# EAGLE design V01 (EAGLE 8.0.0)
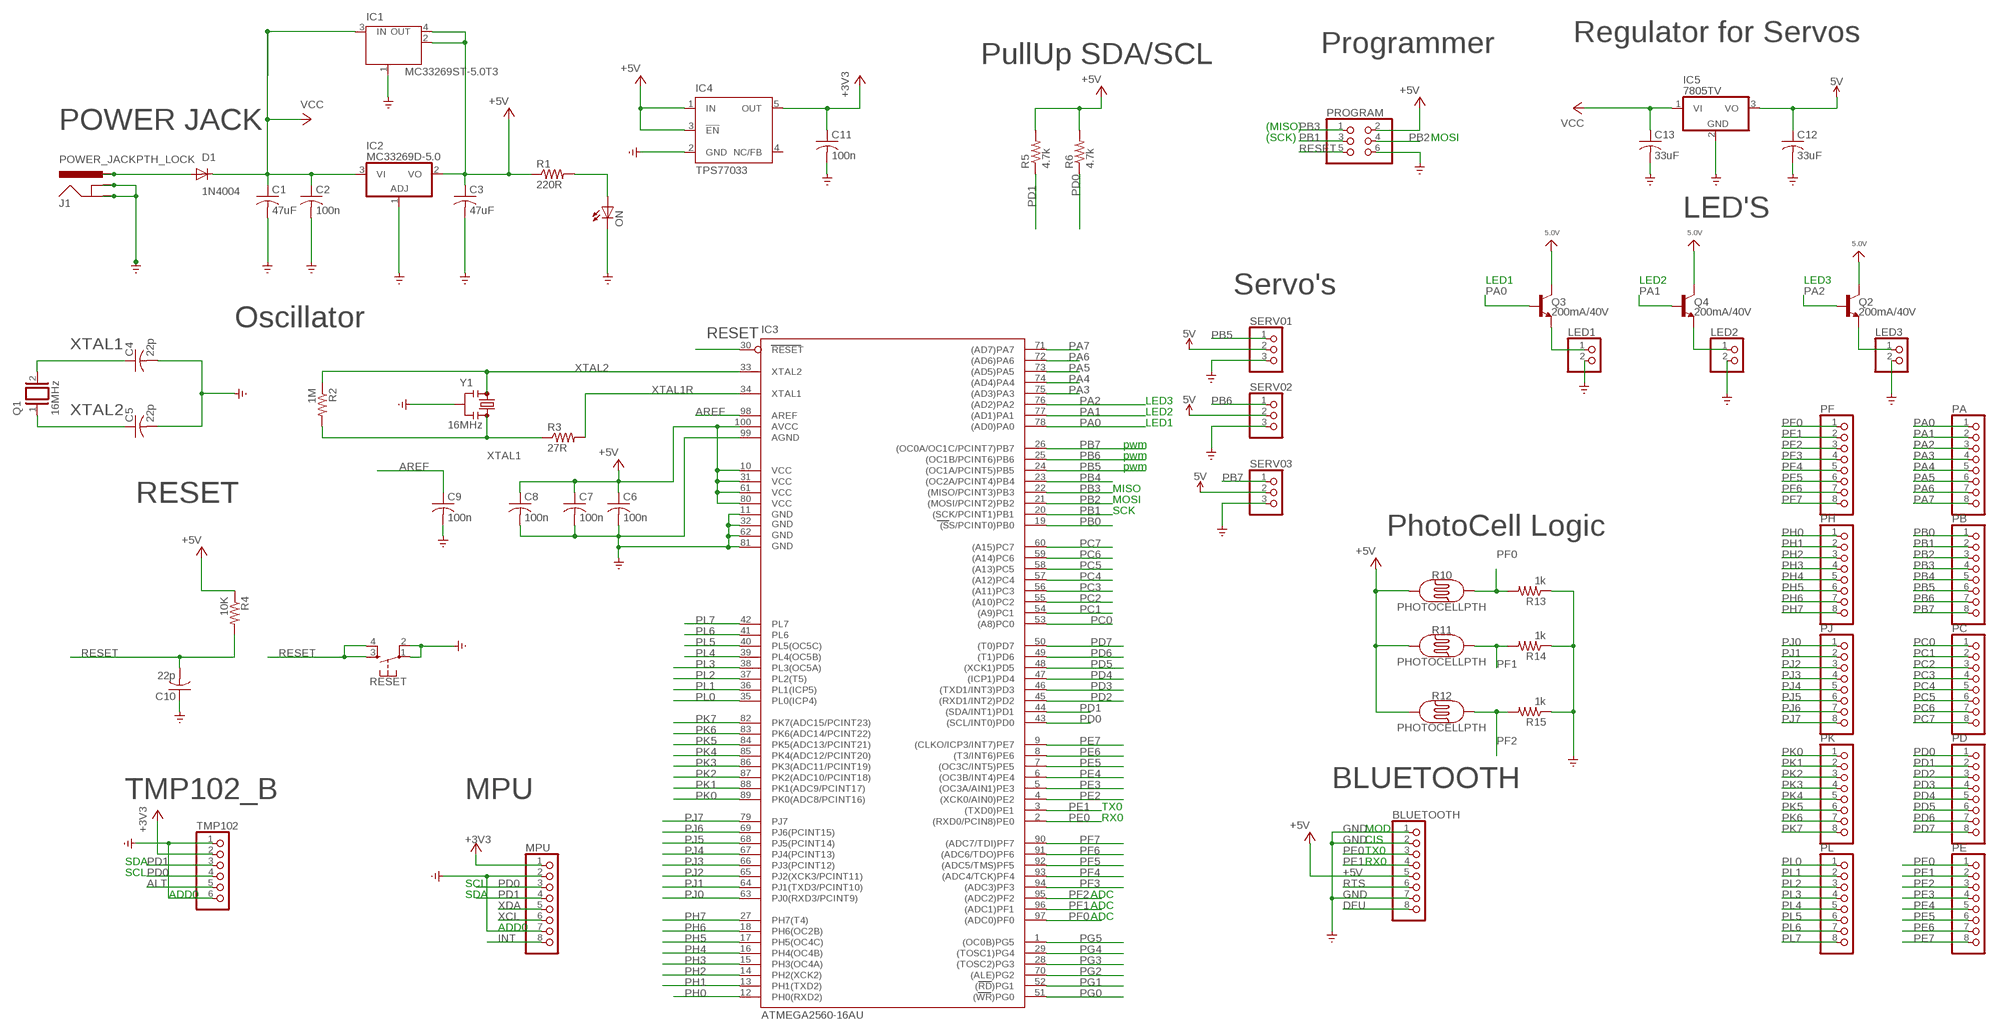
[diagram p0: schematic, sheet 1, part 1 of 2]
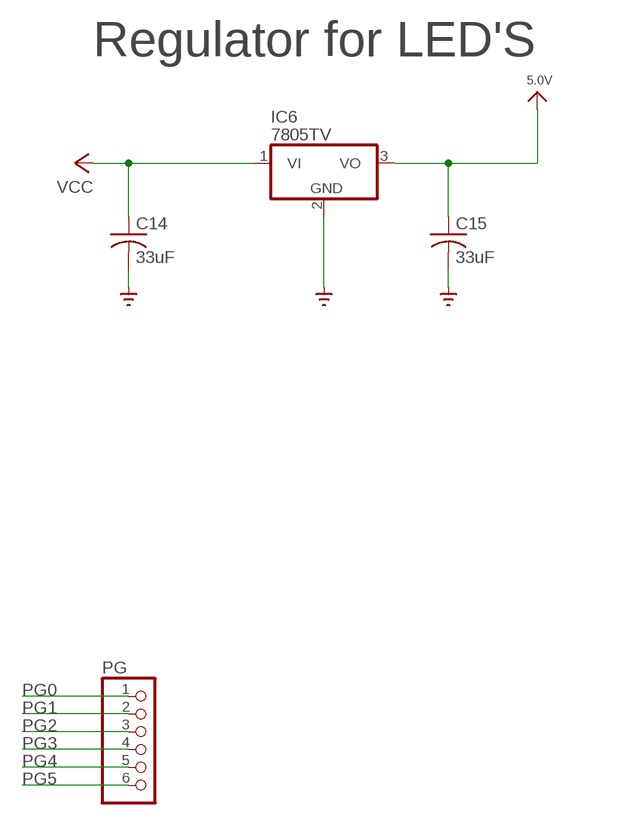
[diagram p1: schematic, sheet 1, part 2 of 2]

## Parts
BLUETOOTH  PINHD-1X8  [1X08]
C1  47uF  C-US025-024X044  [C025-024X044]
C2  100n  C-US025-024X044  [C025-024X044]
C3  47uF  C-US025-024X044  [C025-024X044]
C4  22p  C-US025-024X044  [C025-024X044]
C5  22p  C-US025-024X044  [C025-024X044]
C6  100n  C-US025-024X044  [C025-024X044]
C7  100n  C-US025-024X044  [C025-024X044]
C8  100n  C-US025-024X044  [C025-024X044]
C9  100n  C-US025-024X044  [C025-024X044]
C10  22p  C-US025-024X044  [C025-024X044]
C11  100n  C-US025-024X044  [C025-024X044]
C12  33uF  C-US025-024X044  [C025-024X044]
C13  33uF  C-US025-024X044  [C025-024X044]
C14  33uF  C-US025-024X044  [C025-024X044]
C15  33uF  C-US025-024X044  [C025-024X044]
D1  1N4004  [DO41-10]
IC1  MC33269ST-5.0T3  MC33269ST-3.3T3  [SOT223]
IC2  MC33269D-5.0  [DPACK]
IC3  ATMEGA2560-16AU  [TQFP100]
IC4  TPS77033  [SOT23-DBV]
IC5  7805TV  [TO220V]
IC6  7805TV  [TO220V]
J1  POWER_JACKPTH_LOCK  [POWER_JACK_PTH_LOCK]
LED1  PINHD-1X2  [1X02]
LED2  PINHD-1X2  [1X02]
LED3  PINHD-1X2  [1X02]
MPU  PINHD-1X8  [1X08]
ON  LED3MM  [LED3MM]
PA  PINHD-1X8  [1X08]
PB  PINHD-1X8  [1X08]
PC  PINHD-1X8  [1X08]
PD  PINHD-1X8  [1X08]
PE  PINHD-1X8  [1X08]
PF  PINHD-1X8  [1X08]
PG  PINHD-1X6  [1X06]
PH  PINHD-1X8  [1X08]
PJ  PINHD-1X8  [1X08]
PK  PINHD-1X8  [1X08]
PL  PINHD-1X8  [1X08]
PROGRAM  PINHD-2X3  [2X03]
Q1  16MHz  XTAL/S  [QS]
Q2  200mA/40V  TRANS_NPN-2N3904  [TO-92]
Q3  200mA/40V  TRANS_NPN-2N3904  [TO-92]
Q4  200mA/40V  TRANS_NPN-2N3904  [TO-92]
R1  220R  R-US_0204/2V  [0204V]
R2  1M  R-US_0204/2V  [0204V]
R3  27R  R-US_0204/2V  [0204V]
R4  10K  R-US_0204/2V  [0204V]
R5  4.7k  R-US_0204/2V  [0204V]
R6  4.7k  R-US_0204/2V  [0204V]
R10  PHOTOCELLPTH  [PHOTOCELL]
R11  PHOTOCELLPTH  [PHOTOCELL]
R12  PHOTOCELLPTH  [PHOTOCELL]
R13  1k  R-US_0204/2V  [0204V]
R14  1k  R-US_0204/2V  [0204V]
R15  1k  R-US_0204/2V  [0204V]
RESET  MOMENTARY-SWITCH-SPST-2-SMD-5.2MM  [TACTILE_SWITCH_SMD_5.2MM]
SERV01  PINHD-1X3  [1X03]
SERV02  PINHD-1X3  [1X03]
SERV03  PINHD-1X3  [1X03]
TMP102  PINHD-1X6  [1X06]
Y1  16MHz  RESONATORSMD-3.2X1.3  [RESONATOR-SMD-3.2X1.3]

## Nets
5.0V: C15.1 IC6.3(VO) Q2.3(C) Q3.3(C) Q4.3(C)
5V: C12.1 IC5.3(VO) SERV01.2 SERV02.2 SERV03.2
+3V3: C11.1 IC4.5(OUT) MPU.1 TMP102.2
+5V: BLUETOOTH.5 C3.1 C6.1 C7.1 C8.1 IC1.2(OUT) IC1.4(OUT) IC2.2(VO) IC3.10(VCC) IC3.31(VCC1) IC3.61(VCC2) IC3.80(VCC3) IC3.100(AVCC) IC4.1(IN) IC4.3(!EN) PROGRAM.2 R1.1 R4.1 R5.2 R6.2 R10.1 R11.1 R12.1
ALT: TMP102.5
AREF: C9.1 IC3.98(AREF)
DFU: BLUETOOTH.8
GND: BLUETOOTH.1 BLUETOOTH.2 BLUETOOTH.7 C1.2 C2.2 C3.2 C4.2 C5.2 C6.2 C7.2 C8.2 C9.2 C10.1 C11.2 C12.2 C13.2 C14.2 C15.2 IC1.1(GND/ADJ) IC2.1(ADJ) IC3.11(GND) IC3.32(GND1) IC3.62(GND2) IC3.81(GND3) IC3.99(AGND) IC4.2(GND) IC5.2(GND) IC6.2(GND) J1.GND J1.GNDBREAK LED1.2 LED2.2 LED3.2 MPU.2 MPU.7 ON.K(C) PROGRAM.6 R13.1 R14.1 R15.1 RESET.1 RESET.2 SERV01.3 SERV02.3 SERV03.3 TMP102.1 TMP102.6 Y1.2 ; supply symbol labelled GND_
INT: MPU.8
N$3: ON.A R1.2
N$5: LED1.1 Q3.1(E)
N$6: LED2.1 Q4.1(E)
N$7: LED3.1 Q2.1(E)
PA0: IC3.78((AD0)PA0) PA.1 Q3.2(B)
PA1: IC3.77((AD1)PA1) PA.2 Q4.2(B)
PA2: IC3.76((AD2)PA2) PA.3 Q2.2(B)
PA3: IC3.75((AD3)PA3) PA.4
PA4: IC3.74((AD4)PA4) PA.5
PA5: IC3.73((AD5)PA5) PA.6
PA6: IC3.72((AD6)PA6) PA.7
PA7: IC3.71((AD7)PA7) PA.8
PB0: IC3.19((SS/PCINT0)PB0) PB.1
PB1: IC3.20((SCK/PCINT1)PB1) PB.2 PROGRAM.3
PB2: IC3.21((MOSI/PCINT2)PB2) PB.3 PROGRAM.4
PB3: IC3.22((MISO/PCINT3)PB3) PB.4 PROGRAM.1
PB4: IC3.23((OC2A/PCINT4)PB4) PB.5
PB5: IC3.24((OC1A/PCINT5)PB5) PB.6 SERV01.1
PB6: IC3.25((OC1B/PCINT6)PB6) PB.7 SERV02.1
PB7: IC3.26((OC0A/OC1C/PCINT7)PB7) PB.8 SERV03.1
PC0: IC3.53((A8)PC0) PC.1
PC1: IC3.54((A9)PC1) PC.2
PC2: IC3.55((A10)PC2) PC.3
PC3: IC3.56((A11)PC3) PC.4
PC4: IC3.57((A12)PC4) PC.5
PC5: IC3.58((A13)PC5) PC.6
PC6: IC3.59((A14)PC6) PC.7
PC7: IC3.60((A15)PC7) PC.8
PD0: IC3.43((SCL/INT0)PD0) MPU.3 PD.1 R6.1 TMP102.4
PD1: IC3.44((SDA/INT1)PD1) MPU.4 PD.2 R5.1 TMP102.3
PD2: IC3.45((RXD1/INT2)PD2) PD.3
PD3: IC3.46((TXD1/INT3)PD3) PD.4
PD4: IC3.47((ICP1)PD4) PD.5
PD5: IC3.48((XCK1)PD5) PD.6
PD6: IC3.49((T1)PD6) PD.7
PD7: IC3.50((T0)PD7) PD.8
PE0: BLUETOOTH.3 IC3.2((RXD0/PCIN8)PE0) PE.1
PE1: BLUETOOTH.4 IC3.3((TXD0)PE1) PE.2
PE2: IC3.4((XCK0/AIN0)PE2) PE.3
PE3: IC3.5((OC3A/AIN1)PE3) PE.4
PE4: IC3.6((OC3B/INT4)PE4) PE.5
PE5: IC3.7((OC3C/INT5)PE5) PE.6
PE6: IC3.8((T3/INT6)PE6) PE.7
PE7: IC3.9((CLKO/ICP3/INT7)PE7) PE.8
PF0: IC3.97((ADC0)PF0) PF.1 R10.2 R13.2
PF1: IC3.96((ADC1)PF1) PF.2 R11.2 R14.2
PF2: IC3.95((ADC2)PF2) PF.3 R12.2 R15.2
PF3: IC3.94((ADC3)PF3) PF.4
PF4: IC3.93((ADC4/TCK)PF4) PF.5
PF5: IC3.92((ADC5/TMS)PF5) PF.6
PF6: IC3.91((ADC6/TDO)PF6) PF.7
PF7: IC3.90((ADC7/TDI)PF7) PF.8
PG0: IC3.51((WR)PG0) PG.1
PG1: IC3.52((RD)PG1) PG.2
PG2: IC3.70((ALE)PG2) PG.3
PG3: IC3.28((TOSC2)PG3) PG.4
PG4: IC3.29((TOSC1)PG4) PG.5
PG5: IC3.1((OC0B)PG5) PG.6
PH0: IC3.12(PH0(RXD2)) PH.1
PH1: IC3.13(PH1(TXD2)) PH.2
PH2: IC3.14(PH2(XCK2)) PH.3
PH3: IC3.15(PH3(OC4A)) PH.4
PH4: IC3.16(PH4(OC4B)) PH.5
PH5: IC3.17(PH5(OC4C)) PH.6
PH6: IC3.18(PH6(OC2B)) PH.7
PH7: IC3.27(PH7(T4)) PH.8
PJ0: IC3.63(PJ0(RXD3/PCINT9)) PJ.1
PJ1: IC3.64(PJ1(TXD3/PCINT10)) PJ.2
PJ2: IC3.65(PJ2(XCK3/PCINT11)) PJ.3
PJ3: IC3.66(PJ3(PCINT12)) PJ.4
PJ4: IC3.67(PJ4(PCINT13)) PJ.5
PJ5: IC3.68(PJ5(PCINT14)) PJ.6
PJ6: IC3.69(PJ6(PCINT15)) PJ.7
PJ7: IC3.79(PJ7) PJ.8
PK0: IC3.89(PK0(ADC8/PCINT16)) PK.1
PK1: IC3.88(PK1(ADC9/PCINT17)) PK.2
PK2: IC3.87(PK2(ADC10/PCINT18)) PK.3
PK3: IC3.86(PK3(ADC11/PCINT19)) PK.4
PK4: IC3.85(PK4(ADC12/PCINT20)) PK.5
PK5: IC3.84(PK5(ADC13/PCINT21)) PK.6
PK6: IC3.83(PK6(ADC14/PCINT22)) PK.7
PK7: IC3.82(PK7(ADC15/PCINT23)) PK.8
PL0: IC3.35(PL0(ICP4)) PL.1
PL1: IC3.36(PL1(ICP5)) PL.2
PL2: IC3.37(PL2(T5)) PL.3
PL3: IC3.38(PL3(OC5A)) PL.4
PL4: IC3.39(PL4(OC5B)) PL.5
PL5: IC3.40(PL5(OC5C)) PL.6
PL6: IC3.41(PL6) PL.7
PL7: IC3.42(PL7) PL.8
POWERIN: D1.A J1.PWR
RESET: C10.2 IC3.30(RESET) PROGRAM.5 R4.2 RESET.3 RESET.4
RTS: BLUETOOTH.6
VCC: C1.1 C2.1 C13.1 C14.1 D1.C IC1.3(IN) IC2.3(VI) IC5.1(VI) IC6.1(VI)
XCL: MPU.6
XDA: MPU.5
XTAL1: C4.1 Q1.2 R2.2 R3.1 Y1.3
XTAL1R: IC3.34(XTAL1) R3.2
XTAL2: C5.1 IC3.33(XTAL2) Q1.1 R2.1 Y1.1
Unconnected: IC4.4(NC/FB)

## Notes on the sheet
- Regulator for Servos | Regulator for LED'S
- Programmer
- PullUp SDA/SCL
- POWER JACK | (MISO)
- (SCK) | MOSI
- LED'S
- LED1 | LED2 | LED3
- Servo's
- Oscillator
- LED3
- LED2
- LED1
- pwm
- pwm
- pwm
- MISO
- RESET | MOSI
- SCK
- PhotoCell Logic
- BLUETOOTH
- TMP102_B | MPU
- TX0
- RX0
- MOD
- CIS
- TX0
- SDA | RX0
- SCL
- SCL
- ADD0 | SDA | ADC
- ADC
- ADC
- ADD0

## Library data of the parts
BLUETOOTH MPU PA PB PC PD PE PF PH PJ PK PL = pinhead:PINHD-1X8: PIN HEADER
C1-C15 = adafruit:C-US: CAPACITOR, American symbol
D1 = adafruit:1N4004: DIODE General purpose 1N400x type rectifier (With bigger pads) http://www.ladyada.net/library/pcb/eaglelibrary.html
IC1 = linear:MC33269ST*: Adjustable Output Low Dropout Voltage Regulator 800 mA Source: http://www.onsemi.com/pub/Collateral/MC33269-D.PDF
IC2 = linear:MC33269?*: Adjustable Output Low Dropout Voltage Regulator 800 mA Source: http://www.onsemi.com/pub/Collateral/MC33269-D.PDF
IC3 = atmel-2005:ATMEGA*: MICROCONTROLLER 64/128/256 Kbytes FLASH 4 Kbytes EEPROM 8 Kbytes SRAM 86 General Purpose I/O pins 12-channels16-bit PWM 4 x Serial USARTs 16-channels 10-bit A/D
IC4 = texas:TPS770*: ULTRALOW-POWER 50-mA LOW-DROPOUT LINEAR REGULATORS 50-mA Low-Dropout Regulator Source: http://focus.ti.com/lit/ds/symlink/tps77001.pdf; MF: TEXAS INSTRUMENTS; MPN: TPS77033DBVT; OC_FARNELL: 8461570; OC_NEWARK: 77C1187
IC5 IC6 = linear:78*: Positive VOLTAGE REGULATOR Source: http://cache.national.com/ds/LM/LM78L05.pdf http://www.fairchildsemi.com/ds/LM/LM7805.pdf
J1 = SparkFun-Connectors:POWER_JACK: Power Jack Connector This is the standard 5.5mm barrel jack for power. The PTH is the most common, proven, reliable, footprint. The Slot footprint only works if the mill layer is transmitted to the PCB fab house so be warned. Here are the connectors we sell at SparkFun: DC Barrel Power Jack/Connector <https://www.sparkfun.com/products/119> (PRT-00119) DC Barrel Power Jack/Connector (SMD) <https://www.sparkfun.com/products/12748> (PRT-12748) DC Barrel Jack Adapter - Breadboard Compatible <https://www.sparkfun.com/products/10811> (PRT-10811) It is used on this SparkFun product (and many, many others): SparkFun RedBoard - Programmed with Arduino <https://www.sparkfun.com/products/12757> (DEV-12757) Also, if you need a mating power supply or connector, please check these out: Wall Adapter Power Supply - 9VDC 650mA <https://www.sparkfun.com/products/298> (TOL-00298) DC Barrel Jack Adapter - Male <https://www.sparkfun.com/products/10287> (PRT-10287); PROD_ID: CONN-08197; SF_ID: PRT-00119
LED1-LED3 = pinhead:PINHD-1X2: PIN HEADER
ON = adafruit:LED: LED OSRAM: - CHIPLED LG R971, LG N971, LY N971, LG Q971, LY Q971, LO R971, LY R971 LH N974, LH R974 LS Q976, LO Q976, LY Q976 LO Q996 - Hyper CHIPLED LW Q18S LB Q993, LB Q99A, LB R99A - SideLED LS A670, LO A670, LY A670, LG A670, LP A670 LB A673, LV A673, LT A673, LW A673 LH A674 LY A675 LS A676, LA A676, LO A676, LY A676, LW A676 LS A679, LY A679, LG A679 - Hyper Micro SIDELED® LS Y876, LA Y876, LO Y876, LY Y876 LT Y87S - SmartLED LW L88C, LW L88S LB L89C, LB L89S, LG L890 LS L89K, LO L89K, LY L89K LS L896, LA L896, LO L896, LY L896 - TOPLED LS T670, LO T670, LY T670, LG T670, LP T670 LSG T670, LSP T670, LSY T670, LOP T670, LYG T670 LG T671, LOG T671, LSG T671 LB T673, LV T673, LT T673, LW T673 LH T674 LS T676, LA T676, LO T676, LY T676, LB T676, LH T676, LSB T676, LW T676 LB T67C, LV T67C, LT T67C, LS T67K, LO T67K, LY T67K, LW E67C LS E67B, LA E67B, LO E67B, LY E67B, LB E67C, LV E67C, LT E67C LW T67C LS T679, LY T679, LG T679 LS T770, LO T770, LY T770, LG T770, LP T770 LB T773, LV T773, LT T773, LW T773 LH T774 LS E675, LA E675, LY E675, LS T675 LS T776, LA T776, LO T776, LY T776, LB T776 LHGB T686 LT T68C, LB T68C - Hyper Mini TOPLED® LB M676 - Mini TOPLED Santana® LG M470 LS M47K, LO M47K, LY M47K Source: http://www.osram.convergy.de/
PG TMP102 = pinhead:PINHD-1X6: PIN HEADER
PROGRAM = pinhead:PINHD-2X3: PIN HEADER
Q1 = special:XTAL/S: CRYSTAL
Q2-Q4 = SparkFun-DiscreteSemi:TRANS_NPN: NPN transistor Current controlled devices typically used to amplify current or used as a switch. BC547 - COM-08928 <http://www.sparkfun.com/products/8928> (TO-92 45V 100mA) (1.Collector 2.Base 3.Emitter) 2N3904 - COM-00521 <http://www.sparkfun.com/products/521> (TO-92 40V 200mA) (1.Emitter 2.Base 3.Collector) P2N2222A - COM-12852 <http://www.sparkfun.com/products/12852> (TO-92 40V 600mA) (1.Collector 2.Base 3.Emitter); PROD_ID: TRANS-08447
R1-R6 R13-R15 = resistor:R-US_: RESISTOR, American symbol
R10-R12 = SparkFun-Sensors:PHOTOCELL: Photocell (Photodetector, Photo Resistor, CdS) This is a very small light sensor. A photocell changes (also called a photodetector, photo resistor, CdS or photoconductive cell) resistance depending on the amount of light it is exposed to. These little sensors make great ambient light triggers (when light in the room turns on, do something). Datasheet <http://cdn.sparkfun.com/datasheets/Sensors/LightImaging/SEN-09088.pdf> SparkFun Products Mini Photocell <https://www.sparkfun.com/products/9088> (SEN-09088); PROD_ID: COMP-09129; SF_ID: SEN-09088
RESET = SparkFun-Switches:MOMENTARY-SWITCH-SPST-2: Momentary Switch (Pushbutton) - SPST - Two Circuits Normally-open (NO) SPST momentary switches (buttons, pushbuttons). Schematic symbol includes two switch circuits. Variants SMD-4.6MMX2.8MM - 4.60mm x 2.80mm Tactile Momentary Button Switch - Used on SparkFun SAMD21 Mini Breakout <https://www.sparkfun.com/products/13664> SMD-5.2MM - Mini Pushbutton Switch - SMD <https://www.sparkfun.com/products/8720> - Used on Arduino Pro Mini <https://www.sparkfun.com/products/11114>; PROD_ID: SWCH-08247; SF_SKU: COM-08720
SERV01-SERV03 = pinhead:PINHD-1X3: PIN HEADER
Y1 = SparkFun-Clocks:RESONATOR: Resonators (Generic) Ceramic resonators are clock-generating components, often used to control timing in microcontrollers. They usually have 3 pins: two pins for oscillation, and one pin for ground. Compared to crystals, resonators have worse tolerance, but are usually much cheaper. Plus, they have built-in load capacitors! These devices are used on boards like the Arduino Pro 8MHz <https://www.sparkfun.com/products/11114> and Arduino Pro 16MHz <https://www.sparkfun.com/products/11113>.

## Net classes
0 default: width 0.15 mm, drill 0.3 mm, clearance 0.15 mm

## Board
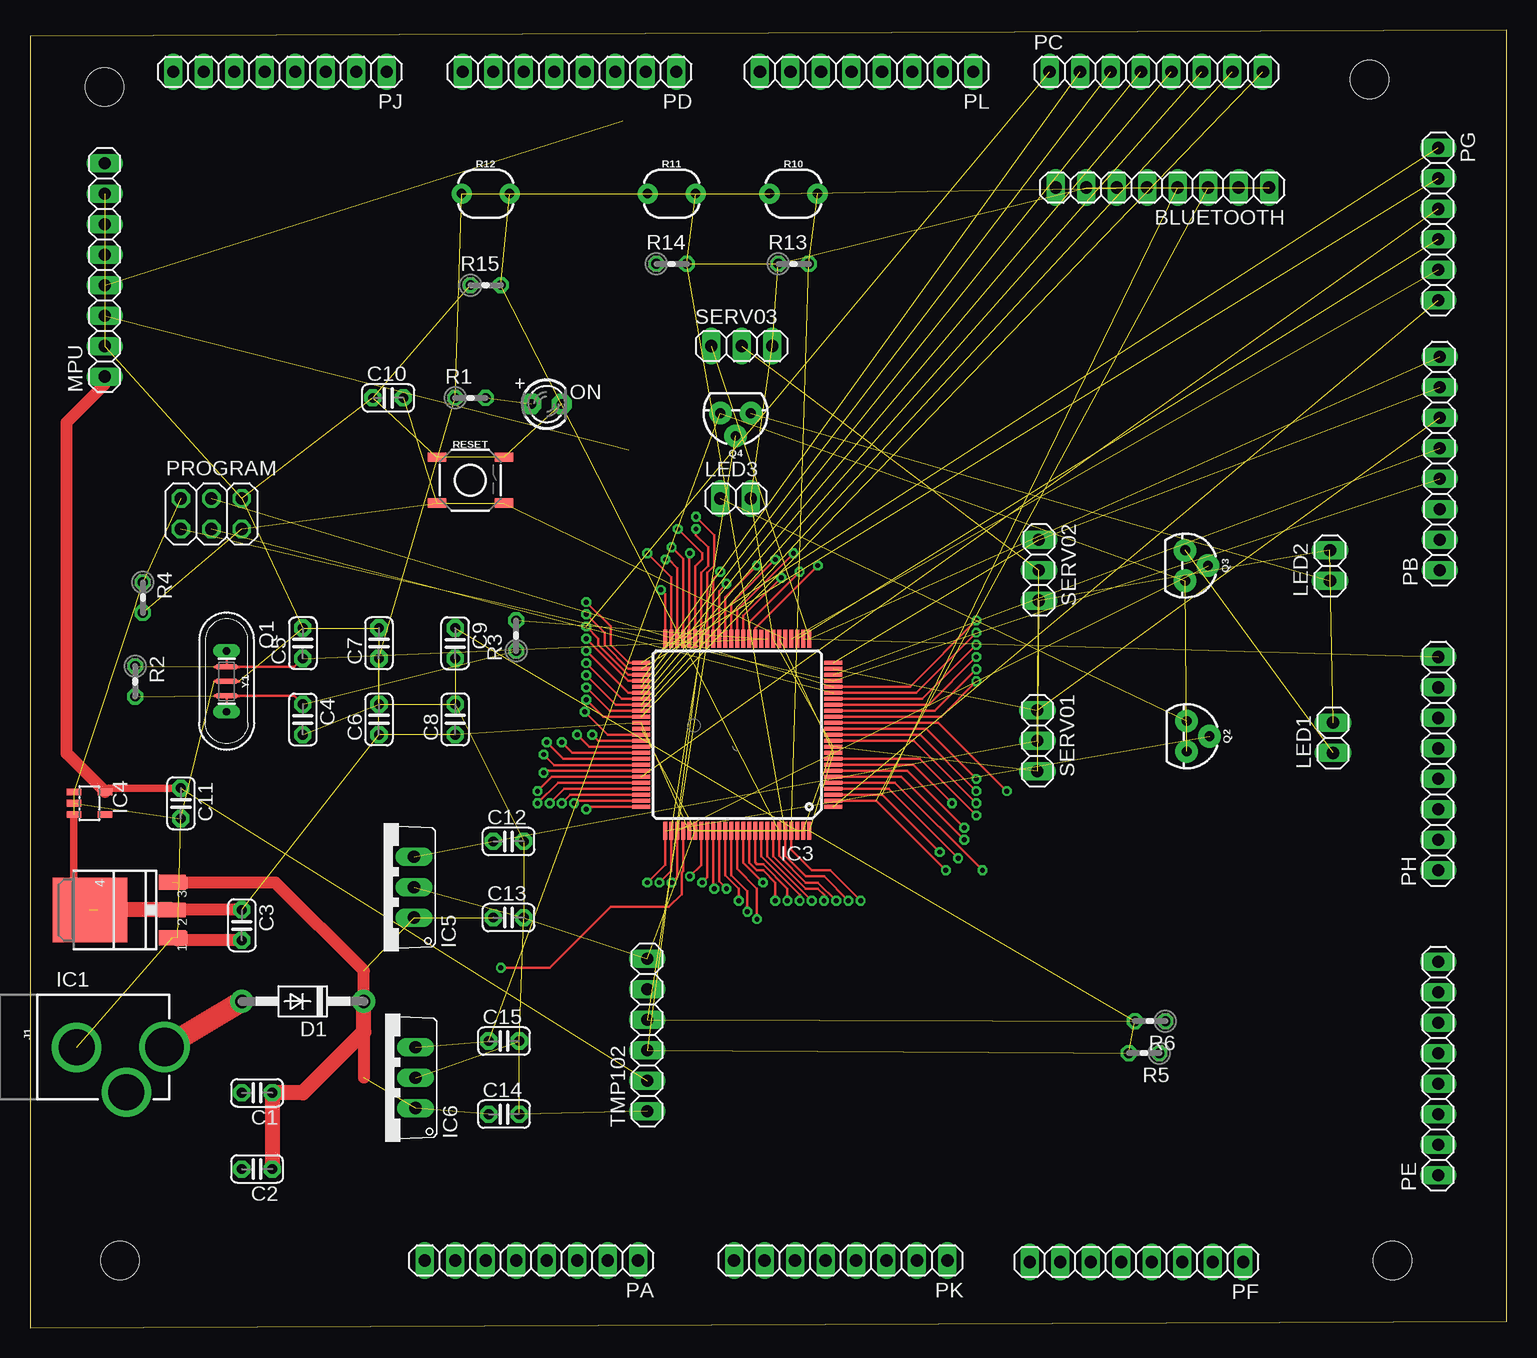
[diagram p2: board, top side]
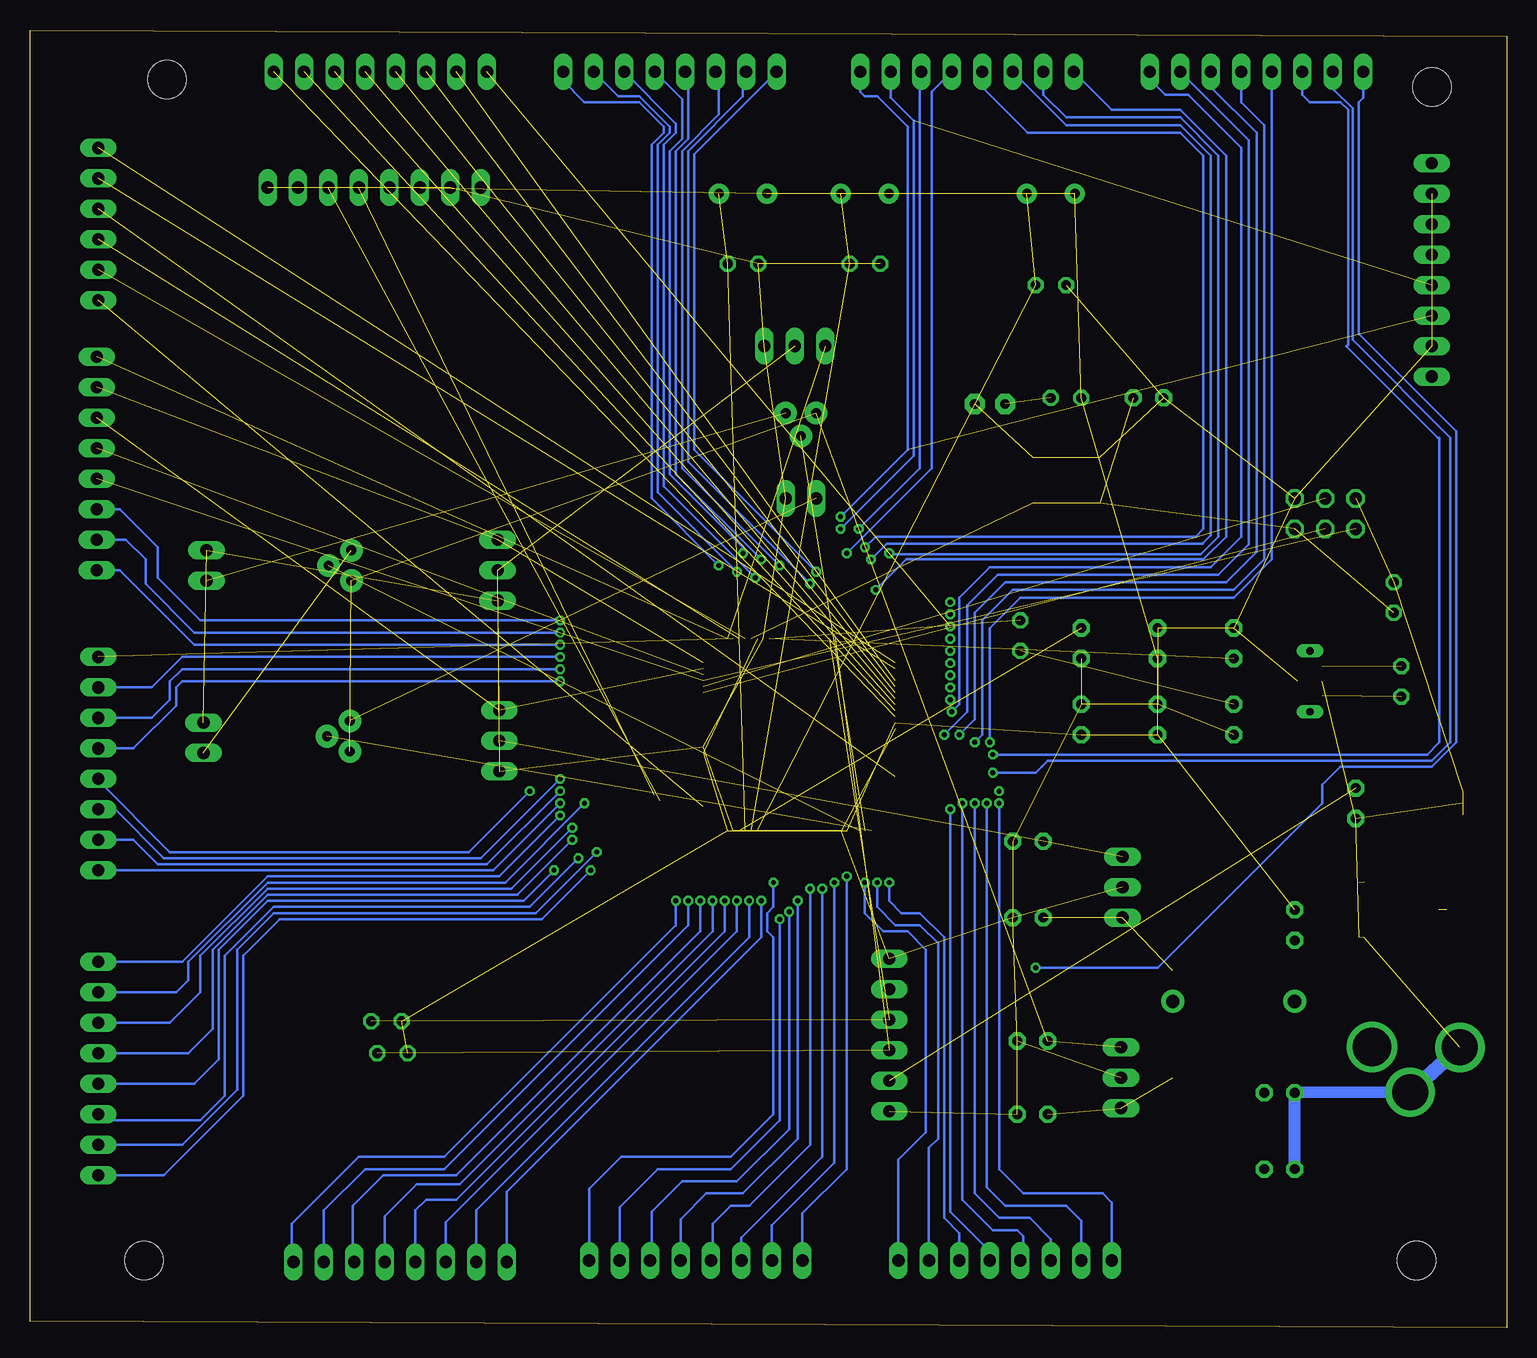
[diagram p3: board, bottom side, seen from below]

Size 123.04 x 108.13 mm. Coordinates in mm from the lower left corner, seen from the top.
Outline: 0,0 123.04,0.51 123.04,108.13 0,107.62 0,0
Copper layers (1*16): Top 0.035mm / dielectric 1.5mm / Bottom 0.035mm
Design rules "default *": minimum track width 0.15mm, minimum drill 0.3mm, track to track 0.15mm, track to pad 0.15mm, pad to pad 0.15mm, via to via 0.15mm, smd to smd 0.15mm, copper to edge 0.6mm, drill to drill 0.3mm, minimum pad ring 10mil, minimum via ring 8mil, stop-mask expansion 2mil, vias tented up to drill 0mil, thermal gap 10mil
Holes 3.2 mm at 6.22,103.38 111.63,104.01 113.54,5.59 7.49,5.59

### Footprints (pad centres in the part's own frame; a part is rotated, then mirrored left to right if it is on the bottom)
1X08 = drill 1.016 long: 1 -8.89,0; 2 -6.35,0; 3 -3.81,0; 4 -1.27,0; 5 1.27,0; 6 3.81,0; 7 6.35,0; 8 8.89,0
C025-024X044 = drill 0.813 pad 1.422 octagon: 1 -1.27,0; 2 1.27,0
DO41-10 = drill 1.118 pad 1.93: A 5.08,0; C -5.08,0
SOT223 = smd 1.219 x 2.235: 1 -2.311,-3.099; 2 0,-3.099; 3 2.311,-3.099 | smd 3.6 x 2.2: 4 0,3.099
DPACK = smd 1 x 1.6: 1 -2.28,-4.8; 3 2.28,-4.8 | smd 5.4 x 6.2: 2 0,2.5
TQFP100 = smd 1.5 x 0.35: 1 -8,6; 2 -8,5.5; 3 -8,5; 4 -8,4.5; 5 -8,4; 6 -8,3.5; 7 -8,3; 8 -8,2.5; 9 -8,2; 10 -8,1.5; 11 -8,1; 12 -8,0.5; 13 -8,0; 14 -8,-0.5; 15 -8,-1; 16 -8,-1.5; 17 -8,-2; 18 -8,-2.5; 19 -8,-3; 20 -8,-3.5; 21 -8,-4; 22 -8,-4.5; 23 -8,-5; 24 -8,-5.5; 25 -8,-6; 51 8,-6; 52 8,-5.5; 53 8,-5; 54 8,-4.5; 55 8,-4; 56 8,-3.5; 57 8,-3; 58 8,-2.5; 59 8,-2; 60 8,-1.5; 61 8,-1; 62 8,-0.5; 63 8,0; 64 8,0.5; 65 8,1; 66 8,1.5; 67 8,2; 68 8,2.5; 69 8,3; 70 8,3.5; 71 8,4; 72 8,4.5; 73 8,5; 74 8,5.5; 75 8,6 | smd 0.35 x 1.5: 26 -6,-8; 27 -5.5,-8; 28 -5,-8; 29 -4.5,-8; 30 -4,-8; 31 -3.5,-8; 32 -3,-8; 33 -2.5,-8; 34 -2,-8; 35 -1.5,-8; 36 -1,-8; 37 -0.5,-8; 38 0,-8; 39 0.5,-8; 40 1,-8; 41 1.5,-8; 42 2,-8; 43 2.5,-8; 44 3,-8; 45 3.5,-8; 46 4,-8; 47 4.5,-8; 48 5,-8; 49 5.5,-8; 50 6,-8; 76 6,8; 77 5.5,8; 78 5,8; 79 4.5,8; 80 4,8; 81 3.5,8; 82 3,8; 83 2.5,8; 84 2,8; 85 1.5,8; 86 1,8; 87 0.5,8; 88 0,8; 89 -0.5,8; 90 -1,8; 91 -1.5,8; 92 -2,8; 93 -2.5,8; 94 -3,8; 95 -3.5,8; 96 -4,8; 97 -4.5,8; 98 -5,8; 99 -5.5,8; 100 -6,8
SOT23-DBV = smd 0.55 x 1.2: 1 -0.95,-1.3; 2 0,-1.3; 3 0.95,-1.3; 4 0.95,1.3; 5 -0.95,1.3
TO220V = drill 1.016 long: 1 -2.54,-2.54; 2 0,-2.54; 3 2.54,-2.54
POWER_JACK_PTH_LOCK = drill 2.997 pad 4.115: GND 0.025,6.557; GNDBREAK 3.762,10.7 | drill 3.2 pad 4.115: PWR 0,13.878
1X02 = drill 1.016 long: 1 -1.27,0; 2 1.27,0
LED3MM = drill 0.813 pad 1.676 octagon: A -1.27,0; K 1.27,0
1X06 = drill 1.016 long: 1 -6.35,0; 2 -3.81,0; 3 -1.27,0; 4 1.27,0; 5 3.81,0; 6 6.35,0
2X03 = drill 1.016 octagon: 1 -2.54,-1.27; 2 -2.54,1.27; 3 0,-1.27; 4 0,1.27; 5 2.54,-1.27; 6 2.54,1.27
QS = drill 0.61 long: 1 -2.54,0; 2 2.54,0
TO-92 = drill 0.813 pad 1.88: 1 -1.27,0; 2 0,1.905; 3 1.27,0
0204V = drill 0.813 octagon: 1 -1.27,0; 2 1.27,0
PHOTOCELL = drill 0.8 pad 1.676: 1 -2,0; 2 2,0
TACTILE_SWITCH_SMD_5.2MM = smd 1.524 x 0.762: 1 -2.794,1.905; 2 2.794,1.905; 3 -2.794,-1.905; 4 2.794,-1.905
1X03 = drill 1.016 long: 1 -2.54,0; 2 0,0; 3 2.54,0
RESONATOR-SMD-3.2X1.3 = smd 0.45 x 1.905: 1 -1.2,0; 2 0,0; 3 1.2,0

### Placement (x,y rotation side)
BLUETOOTH  94.36,95 180 top
C1  18.92,19.56 180 top
C2  18.92,13.21 180 top
C3  17.65,33.53 270 top
C4  22.73,50.67 270 top
C5  22.73,57.02 90 top
C6  29.08,50.67 90 top
C7  29.08,57.02 90 top
C8  35.43,50.67 90 top
C9  35.43,57.02 270 top
C10  29.85,77.47 0 top
C11  12.57,43.69 270 top
C12  39.88,40.51 0 top
C13  39.88,34.16 0 top
C14  39.5,17.78 0 top
C15  39.5,23.88 0 top
D1  22.73,27.18 180 top
IC1  8.76,34.8 90 top
IC2  7.49,34.8 90 top
IC3  58.93,49.4 180 top
IC4  4.95,43.69 270 top
IC5  29.46,36.7 90 top
IC6  29.59,20.83 90 top
J1  -2.67,23.37 270 top
LED1  108.58,49.15 90 top
LED2  108.33,63.5 90 top
LED3  58.8,69.09 0 top
MPU  6.22,88.14 90 top
ON  43.05,76.96 0 top
PA  41.78,5.59 180 top
PB  117.47,72.01 90 top
PC  93.85,104.65 0 top
PD  44.96,104.65 180 top
PE  117.35,21.59 90 top
PF  92.2,5.46 180 top
PG  117.35,91.95 270 top
PH  117.35,46.99 90 top
PJ  20.83,104.65 180 top
PK  67.56,5.59 180 top
PL  69.72,104.65 180 top
PROGRAM  15.11,67.82 0 top
Q1  16.38,53.85 270 top
Q2  96.39,49.28 270 top
Q3  96.27,63.5 270 top
Q4  58.8,76.2 180 top
R1  36.7,77.47 0 top
R2  8.76,53.85 270 top
R3  40.51,57.66 90 top
R4  9.4,60.83 270 top
R5  92.84,22.86 180 top
R6  93.34,25.53 180 top
R10  63.63,94.49 0 top
R11  53.47,94.49 0 top
R12  37.97,94.49 0 top
R13  63.63,88.65 0 top
R14  53.47,88.65 0 top
R15  37.97,86.87 0 top
RESET  36.7,70.61 0 top
SERV01  83.95,48.89 270 top
SERV02  84.07,63.12 270 top
SERV03  59.31,81.79 0 top
TMP102  51.44,24.38 90 top
Y1  16.38,53.85 270 top

### Tracks (layer width: path | path; a pad name or v marks a point on that pad's centre or on a via)
5.0V  (4 unrouted)
5V  (4 unrouted)
+3V3  (1 unrouted)
  Top 0.61: IC4.5 6.57,44.96 C11.1
  Top 1.016: IC4.5 3.05,47.84 3.05,75.44 6.22,78.61 MPU.1
+5V  (19 unrouted)
  Top 0.61: IC4.3 3.65,36.14 IC2.2
  Top 1.016: C3.1 IC1.2
  Top 1.27: IC1.2 IC1.4
AREF  (1 unrouted)
GND  (43 unrouted)
  Top 0.61: 12.29,32.26 IC2.1
  Top 1.016: C3.2 12.29,32.26
  Bottom 1.016: J1.GNDBREAK C1.2 C2.2
  Bottom 1.27: J1.GND J1.GNDBREAK
N$3  (1 unrouted)
N$5  (1 unrouted)
N$6  (1 unrouted)
N$7  (1 unrouted)
PA0  (via drill 0.41)  (1 unrouted)
  Top 0.203: IC3.78 53.93,37.55 v53.47,37.08
  Bottom 0.203: PA.1 50.67,13.97 48.39,16.26 48.39,31.5 49.91,33.02 51.94,33.02 53.47,34.54 v53.47,37.08
PA1  (via drill 0.41)  (1 unrouted)
  Top 0.203: IC3.77 53.43,38.06 v52.45,37.08
  Bottom 0.203: v52.45,37.08 52.45,35.05 50.93,33.53 48.9,33.53 47.37,32 47.37,15.75 48.13,14.99 PA.2
PA2  (via drill 0.41)  (1 unrouted)
  Top 0.203: IC3.76 52.93,38.58 v51.44,37.08
  Bottom 0.203: PA.3 45.59,7.87 46.86,9.14 46.86,32.51 48.9,34.54 50.42,34.54 51.44,35.56 v51.44,37.08
PA3  (via drill 0.41)
  Top 0.203: IC3.75 46.58,43.4 v46.36,43.18
  Bottom 0.203: PA.4 43.05,6.35 46.36,9.65 v46.36,43.18
PA4  (via drill 0.41)
  Top 0.203: IC3.74 45.55,43.9 v45.34,43.69
  Bottom 0.203: v45.34,43.69 45.34,10.67 42.8,8.13 40.77,8.13 40.26,7.62 40.26,5.84 PA.5
PA5  (via drill 0.41)
  Top 0.203: IC3.73 45.04,44.4 v44.32,43.69
  Bottom 0.203: PA.6 37.97,7.37 39.75,9.14 42.29,9.14 44.32,11.18 v44.32,43.69
PA6  (via drill 0.41)
  Top 0.203: IC3.72 44.52,44.9 v43.31,43.69
  Bottom 0.203: v43.31,43.69 43.31,11.68 41.78,10.16 36.7,10.16 35.43,8.89 PA.7
PA7  (via drill 0.41)
  Top 0.203: IC3.71 44.01,45.4 v42.29,43.69
  Bottom 0.203: v42.29,43.69 42.29,13.21 40.26,11.18 33.66,11.18 32.89,10.41 PA.8
PB0  (via drill 0.41)
  Top 0.203: IC3.19 74.37,52.4 v78.87,56.9
  Bottom 0.203: PB.1 115.57,63.12 109.35,56.9 v78.87,56.9
PB1  (via drill 0.41)  (1 unrouted)
  Top 0.203: IC3.20 73.86,52.9 v78.87,57.91
  Bottom 0.203: PB.2 115.06,65.66 113.41,64.01 113.41,61.98 109.35,57.91 v78.87,57.91
PB2  (via drill 0.41)  (1 unrouted)
  Top 0.203: IC3.21 73.34,53.4 v78.87,58.93
  Bottom 0.203: PB.3 115.57,68.2 112.39,65.02 112.39,62.48 108.84,58.93 v78.87,58.93
PB3  (2 unrouted)
PB4  (1 unrouted)
PB5  (2 unrouted)
PB6  (2 unrouted)
PB7  (2 unrouted)
PC0  (via drill 0.41)  (1 unrouted)
  Top 0.203: IC3.53 49.86,54.4 47.37,56.9 47.37,57.4 v46.36,58.42
PC1  (via drill 0.41)  (1 unrouted)
  Top 0.203: IC3.54 49.86,53.9 v46.36,57.4
PC2  (1 unrouted)
PC3  (via drill 0.41)  (1 unrouted)
  Top 0.203: IC3.56 49.84,52.9 v46.36,56.39
PC4  (via drill 0.41)  (1 unrouted)
  Top 0.203: IC3.57 49.32,52.4 v46.36,55.37
PC5  (via drill 0.41)  (1 unrouted)
  Top 0.203: IC3.58 48.81,51.9 v46.36,54.36
PC6  (via drill 0.41)  (1 unrouted)
  Top 0.203: IC3.59 48.29,51.4 v46.36,53.34
PC7  (via drill 0.41)  (1 unrouted)
  Top 0.203: IC3.60 47.78,50.9 v46.36,52.32
PD0  (via drill 0.41)  (3 unrouted)
  Top 0.203: IC3.43 56.43,62.91 57.02,63.5 57.02,66.04 v55.5,67.56
  Bottom 0.203: v55.5,67.56 49.91,73.15 49.91,100.08 52.45,102.62 53.47,102.62 53.85,103 PD.1
PD1  (via drill 0.41)  (3 unrouted)
  Top 0.203: v55.5,66.55 55.5,66.04 56.52,65.02 56.52,63.5 55.93,62.91 IC3.44
  Bottom 0.203: PD.2 51.31,102.49 49.4,100.58 49.4,72.64 v55.5,66.55
PD2  (via drill 0.41)
  Top 0.203: IC3.45 55.43,63.43 56.01,64.01 56.01,64.52 v53.98,66.55
  Bottom 0.203: v53.98,66.55 48.9,71.63 48.9,104.52 PD.3
PD3  (via drill 0.41)
  Top 0.203: IC3.46 54.93,64.45 v54.99,64.52
  Bottom 0.203: PD.4 47.88,103 47.88,71.63 v54.99,64.52
PD4  (via drill 0.41)
  Top 0.203: IC3.47 54.43,64.06 v53.47,65.02
  Bottom 0.203: PD.5 43.69,103.38 39.88,99.57 27.18,99.57 25.27,97.66 25.27,66.55 25.91,65.91 52.58,65.91 v53.47,65.02
PD5  (via drill 0.41)
  Top 0.203: IC3.48 53.93,63.29 53.21,64.01 v52.96,64.01
  Bottom 0.203: PD.6 36.7,100.2 27.18,100.2 24.64,97.66 24.64,66.04 25.3,65.37 25.3,65.31 51.66,65.31 v52.96,64.01
PD6  (via drill 0.41)
  Top 0.203: v51.44,64.52 53.43,62.52 IC3.49
  Bottom 0.203: PD.7 38.61,102.74 36.7,100.84 27.18,100.84 24,97.66 24,65.91 25.5,64.42 51.34,64.42 v51.44,64.52
PD7  (via drill 0.41)
  Top 0.203: IC3.50 52.93,61.12 v52.58,61.47
  Bottom 0.203: PD.8 32.89,101.47 27.18,101.47 23.37,97.66 23.37,65.91 25.27,64.01 50.04,64.01 v52.58,61.47
PE0  (via drill 0.41)  (1 unrouted)
  Top 0.203: IC3.2 70.52,43.9 v76.33,38.1
  Bottom 0.203: PE.1 111.89,12.7 105.28,19.3 105.28,30.99 102.23,34.04 80.39,34.04 v76.33,38.1
PE1  (via drill 0.41)  (1 unrouted)
  Top 0.203: IC3.3 71.04,44.4 v75.82,39.62
  Bottom 0.203: PE.2 110.36,15.24 105.79,19.81 105.79,31.5 102.74,34.54 80.9,34.54 v75.82,39.62
PE2  (via drill 0.41)
  Top 0.203: IC3.4 71.56,44.9 v77.34,39.12
  Bottom 0.203: v77.34,39.12 81.41,35.05 102.74,35.05 106.81,30.99 106.81,19.3 108.84,17.27 116.84,17.27 PE.3
PE3  (via drill 0.41)
  Top 0.203: IC3.5 72.07,45.4 v79.38,38.1
  Bottom 0.203: PE.4 109.35,20.32 107.31,22.35 107.31,31.5 103.25,35.56 81.92,35.56 v79.38,38.1
PE4  (via drill 0.41)
  Top 0.203: IC3.6 72.59,45.9 v77.85,40.64
  Bottom 0.203: v77.85,40.64 82.42,36.07 103.25,36.07 107.82,31.5 107.82,24.89 109.86,22.86 PE.5
PE5  (via drill 0.41)
  Top 0.203: IC3.7 73.1,46.4 v77.85,41.66
  Bottom 0.203: PE.6 111.38,25.4 108.84,27.94 108.84,30.99 103.25,36.58 82.93,36.58 v77.85,41.66
PE6  (via drill 0.41)
  Top 0.203: IC3.8 73.62,46.9 v76.83,43.69
  Bottom 0.203: v76.83,43.69 83.44,37.08 103.25,37.08 109.86,30.48 109.86,28.96 110.87,27.94 PE.7
PE7  (via drill 0.41)
  Top 0.203: IC3.9 74.14,47.4 v78.87,42.67
  Bottom 0.203: PE.8 110.36,30.48 103.25,37.59 83.95,37.59 v78.87,42.67
PF0  (via drill 0.41)  (2 unrouted)
  Top 0.203: IC3.97 63.43,39.82 65.15,38.1 66.67,38.1 v69.22,35.56
  Bottom 0.203: v69.22,35.56 69.22,33.53 88.52,14.22 95.63,14.22 101.22,8.64 101.22,5.59 PF.1
PF1  (via drill 0.41)  (2 unrouted)
  Top 0.203: IC3.96 62.93,39.31 64.64,37.59 66.17,37.59 v68.2,35.56
  Bottom 0.203: PF.2 98.55,9.78 95.12,13.21 88.52,13.21 68.2,33.53 v68.2,35.56
PF2  (via drill 0.41)  (2 unrouted)
  Top 0.203: IC3.95 62.43,39.3 64.64,37.08 65.66,37.08 v67.18,35.56
  Bottom 0.203: v67.18,35.56 67.18,33.02 87.5,12.7 93.6,12.7 96.14,10.16 96.14,5.59 PF.3
PF3  (via drill 0.41)
  Top 0.203: IC3.94 61.93,39.29 64.64,36.58 65.66,36.58 66.17,36.07 v66.17,35.56
  Bottom 0.203: v66.17,35.56 66.17,33.02 87.25,11.94 90.81,11.94 93.47,9.27 PF.4 93.47,5.71
PF4  (via drill 0.41)
  Top 0.203: IC3.93 61.43,39.28 v65.15,35.56
  Bottom 0.203: v65.15,35.56 65.15,33.02 87.5,10.67 90.04,10.67 90.93,9.78 PF.5 90.93,7.24
PF5  (via drill 0.41)
  Top 0.203: IC3.92 60.93,39.27 64.13,36.07 v64.13,35.56
  Bottom 0.203: v64.13,35.56 64.13,33.02 88.39,8.76 PF.6
PF6  (via drill 0.41)
  Top 0.203: IC3.91 60.43,38.76 60.58,38.61 61.09,38.61 63.12,36.58 v63.12,35.56
  Bottom 0.203: v63.12,35.56 63.12,32.51 85.85,9.78 PF.7
PF7  (via drill 0.41)
  Top 0.203: IC3.90 59.93,38.75 60.58,38.1 61.09,38.1 62.1,37.08 v62.1,35.56
  Bottom 0.203: PF.8 83.31,11.3 62.1,32.51 v62.1,35.56
PG0  (via drill 0.41)  (1 unrouted)
  Top 0.203: IC3.51 49.88,55.4 48.39,56.9 48.39,58.42 v46.36,60.45
PG1  (via drill 0.41)  (1 unrouted)
  Top 0.203: IC3.52 49.87,54.9 47.88,56.9 47.88,57.91 v46.36,59.44
PG2  (via drill 0.41)  (1 unrouted)
  Top 0.203: IC3.70 43.49,45.9 v42.29,44.7
PG3  (1 unrouted)
PG4  (1 unrouted)
PG5  (1 unrouted)
PH0  (via drill 0.41)
  Top 0.203: IC3.12 73.65,48.9 v78.87,43.69
  Bottom 0.203: PH.1 84.45,38.1 v78.87,43.69
PH1  (via drill 0.41)
  Top 0.203: IC3.13 74.17,49.4 v78.87,44.7
  Bottom 0.203: PH.2 114.43,40.64 112.39,38.61 84.96,38.61 v78.87,44.7
PH2  (via drill 0.41)
  Top 0.203: IC3.14 74.68,49.9 v78.87,45.72
  Bottom 0.203: PH.3 115.95,43.18 111.89,39.12 85.47,39.12 v78.87,45.72
PH3  (via drill 0.41)
  Top 0.203: IC3.15 75.71,50.4 v81.41,44.7
  Bottom 0.203: PH.4 117.35,45.59 111.38,39.62 86.49,39.62 v81.41,44.7
PH4  (via drill 0.41)
  Top 0.203: IC3.16 75.92,50.9 v78.87,53.85
  Bottom 0.203: PH.5 114.43,48.26 110.87,51.82 110.87,53.34 110.36,53.85 v78.87,53.85
PH5  (via drill 0.41)
  Top 0.203: IC3.17 75.41,51.4 v78.87,54.86
  Bottom 0.203: v78.87,54.86 110.36,54.86 111.38,53.85 111.38,52.32 112.9,50.8 PH.6
PH6  (via drill 0.41)
  Top 0.203: IC3.18 74.89,51.9 v78.87,55.88
  Bottom 0.203: PH.7 112.9,53.34 110.36,55.88 v78.87,55.88
PH7  (1 unrouted)
PJ0  (via drill 0.41)
  Top 0.203: IC3.63 48.13,49.4 v46.23,51.31
  Bottom 0.203: PJ.1 29.72,104.01 28.45,102.74 26.54,102.74 22.1,98.3 22.1,65.91 24.64,63.37 43.05,63.37 45.59,60.83 45.59,51.94 v46.23,51.31
PJ1  (via drill 0.41)
  Top 0.203: IC3.64 47.36,48.9 v46.86,49.4
  Bottom 0.203: PJ.2 21.46,98.93 21.46,65.28 24,62.74 42.42,62.74 44.96,60.2 44.96,51.31 v46.86,49.4
PJ2  (via drill 0.41)
  Top 0.203: IC3.65 46.59,48.4 v45.59,49.4
  Bottom 0.203: PJ.3 24.64,103.38 20.83,99.57 20.83,64.64 23.37,62.1 41.78,62.1 44.32,59.56 44.32,50.67 v45.59,49.4
PJ3  (via drill 0.41)
  Top 0.203: IC3.66 45.19,47.9 v44.32,48.77
  Bottom 0.203: v44.32,48.77 43.69,49.4 43.69,58.93 41.15,61.47 22.73,61.47 20.19,64.01 20.19,100.2 22.1,102.11 PJ.4
PJ4  (via drill 0.41)
  Top 0.203: IC3.67 44.42,47.4 v43.05,48.77
  Bottom 0.203: PJ.5 19.56,64.01 22.73,60.83 40.51,60.83 43.05,58.29 v43.05,48.77
PJ5  (via drill 0.41)
  Top 0.203: IC3.68 50.89,46.86 43.69,46.86 v42.8,47.75
  Bottom 0.203: v42.8,47.75 6.6,47.75 5.59,48.77 5.59,74.17 5.71,74.17 13.34,81.79 13.21,81.91 13.21,101.47 13.84,102.11 16.38,102.11 17.02,102.74 PJ.6
PJ6  (via drill 0.41)
  Top 0.203: IC3.69 42.97,46.4 v42.8,46.23
  Bottom 0.203: v42.8,46.23 39.24,46.23 38.73,46.74 38.23,47.24 6.22,47.24 4.7,48.77 4.7,74.17 12.83,82.3 12.83,101.6 14.35,103.12 14.35,104.52 PJ.7
PJ7  (via drill 0.41)
  Top 0.203: v39.24,29.97 43.31,29.97 48.39,35.05 53.24,35.05 54.29,36.1 54.29,37.91 54.43,38.05 IC3.79
  Bottom 0.203: v39.24,29.97 29.08,29.97 15.37,43.69 15.37,45.21 13.84,46.74 6.22,46.74 4.19,48.77 4.19,74.68 12.32,82.8 12.32,102.11 11.94,102.49 PJ.8
PK0  (via drill 0.41)
  Top 0.203: IC3.89 59.43,38.74 v61.09,37.08
  Bottom 0.203: PK.1 76.45,11.56 73.79,14.22 64.64,14.22 61.09,17.78 61.09,32.51 61.59,33.02 61.59,34.54 61.09,35.05 v61.09,37.08
PK1  (via drill 0.41)
  Top 0.203: IC3.88 58.93,38.23 60.58,36.58 v60.58,34.04
  Bottom 0.203: PK.2 73.91,10.03 70.74,13.21 64.64,13.21 60.58,17.27 v60.58,34.04
PK2  (via drill 0.41)
  Top 0.203: IC3.87 58.43,37.71 59.79,36.35 v59.79,34.64
  Bottom 0.203: v59.79,34.64 59.79,16.54 64.13,12.19 68.71,12.19 71.25,9.65 71.25,5.71 PK.3
PK3  (via drill 0.41)
  Top 0.203: IC3.86 57.93,37.7 59.05,36.58 v59.05,35.56
  Bottom 0.203: PK.4 68.83,9.02 66.67,11.18 63.63,11.18 59.05,15.75 v59.05,35.56
PK4  (via drill 0.41)
  Top 0.203: IC3.85 57.43,37.19 v58.04,36.58
  Bottom 0.203: v58.04,36.58 58.04,15.24 63.12,10.16 64.64,10.16 66.17,8.64 66.17,5.71 PK.5
PK5  (via drill 0.41)
  Top 0.203: IC3.84 56.93,36.67 v57.02,36.58
  Bottom 0.203: PK.6 63.75,7.49 57.02,14.22 v57.02,36.58
PK6  (via drill 0.41)
  Top 0.203: IC3.83 56.43,37.51 v56.01,37.08
  Bottom 0.203: v56.01,37.08 56.01,13.72 61.21,8.51 PK.7
PK7  (via drill 0.41)
  Top 0.203: IC3.82 55.93,38.53 v54.99,37.59
  Bottom 0.203: PK.8 58.67,9.53 54.99,13.21 v54.99,37.59
PL0  (via drill 0.41)
  Top 0.203: IC3.35 60.43,58.27 v65.66,63.5
  Bottom 0.203: PL.1 78.61,103.89 76.83,102.11 72.26,102.11 70.23,100.08 70.23,99.57 71.25,98.55 71.25,69.09 v65.66,63.5
PL1  (via drill 0.41)
  Top 0.203: IC3.36 59.93,58.78 v64.13,62.99
  Bottom 0.203: PL.2 74.04,102.62 72.26,102.62 69.72,100.08 69.72,99.57 70.74,98.55 70.74,69.6 v64.13,62.99
PL2  (via drill 0.41)
  Top 0.203: IC3.37 59.43,59.3 v62.61,62.48
  Bottom 0.203: PL.3 69.22,100.33 69.22,99.57 70.23,98.55 70.23,70.1 v62.61,62.48
PL3  (via drill 0.41)
  Top 0.203: IC3.38 58.93,59.82 v63.63,64.52
  Bottom 0.203: PL.4 68.71,102.36 68.71,99.06 69.72,98.04 69.72,71.12 63.63,65.02 v63.63,64.52
PL4  (via drill 0.41)
  Top 0.203: IC3.39 58.43,60.33 v62.1,64.01
  Bottom 0.203: PL.5 68.2,104.39 68.2,99.06 69.22,98.04 69.22,71.12 v62.1,64.01
PL5  (via drill 0.41)
  Top 0.203: IC3.40 57.93,60.85 v60.58,63.5
  Bottom 0.203: PL.6 65.66,104.39 65.66,101.09 68.71,98.04 68.71,71.63 v60.58,63.5
PL6  (via drill 0.41)
  Top 0.203: IC3.41 57.43,61.36 v58.04,61.98
  Bottom 0.203: PL.7 63.63,104.39 63.63,102.62 68.2,98.04 68.2,72.14 v58.04,61.98
PL7  (via drill 0.41)
  Top 0.203: IC3.42 56.93,62.39 v57.53,62.99
  Bottom 0.203: PL.8 67.69,97.79 67.69,73.15 v57.53,62.99
POWERIN
  Top 1.778: J1.PWR D1.A
RESET  (5 unrouted)
VCC  (5 unrouted)
  Top 1.016: D1.C 27.81,29.72 20.45,37.08 IC2.3 | 27.81,24.64 27.81,20.83
  Top 1.27: D1.C 27.81,24.64 22.73,19.56 C1.1 C2.1
XTAL1  (2 unrouted)
  Top 0.203: Q1.2 Y1.3 22.03,52.65 C4.1
XTAL1R  (1 unrouted)
XTAL2  (2 unrouted)
  Top 0.203: Q1.1 Y1.1 22.03,55.05 C5.1